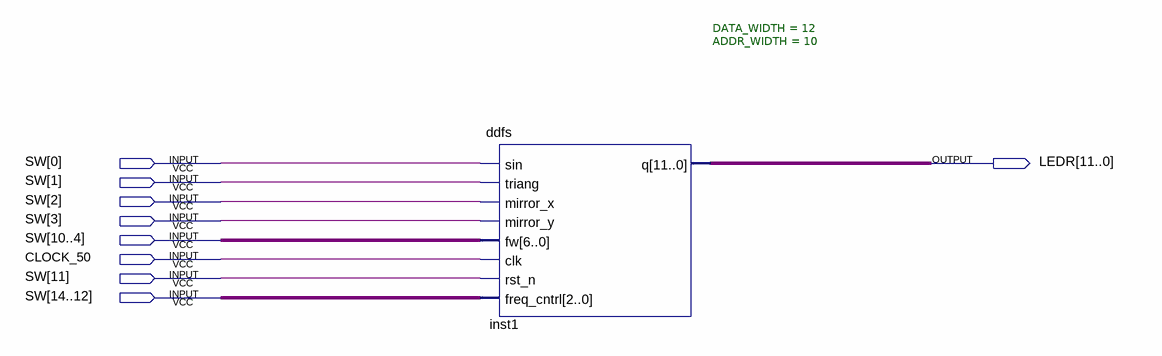
[diagram p0: schematic sheet]
// Quartus schematic funct_gen.bdf as structural Verilog: 1 symbols, 9 pins
module funct_gen (
  input  [14:0] SW,
  input  CLOCK_50,
  output [11:0] LEDR
);

  ddfs #(.DATA_WIDTH(12), .ADDR_WIDTH(10)) inst1 (
    .sin(SW[0]), .triang(SW[1]), .mirror_x(SW[2]), .mirror_y(SW[3]), .fw(SW[10:4]), .clk(CLOCK_50),
    .rst_n(SW[11]), .freq_cntrl(SW[14:12]), .q(LEDR));
endmodule
